# EAGLE design ADP1612_Boost_Converter (EAGLE 9.6.2)
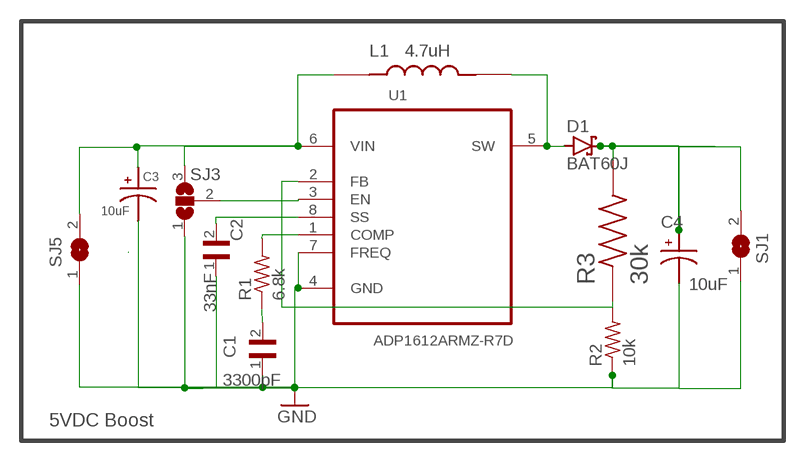
[diagram p0: schematic, sheet 1]

## Parts
C1  3300pF  GRM033R71E332KA12J  [CAPC0603X33N]
C2  33nF  GCM219R71H334KA55J  [CAPC2012X95N]
C3  10uF  EEE-1CA100SR  [CAPAE430X550N]
C4  10uF  EEE-1CA100SR  [CAPAE430X550N]
D1  BAT60J  [SOD323_ST]
L1  4.7uH  LQH43NZ4R7M03L  [IND_LQH43NZ4R7M03L]
R1  6.8k  RP73PF2A10KBTDF  [RESC2012X65N]
R2  10k  RP73PF2A10KBTDF  [RESC2012X65N]
R3  30k  352130KFT  [RESC6332X65N]
SJ1  SJW  [SJW]
SJ3  SJ2WW  [SJ_2W]
SJ5  SJW  [SJW]
U1  ADP1612ARMZ-R7D  [SOIC-08]

## Nets
5VDC: C4.1 D1.C R3.2 SJ1.2
GND: C1.1 C2.1 C3.2 C4.2 R2.1 SJ1.1 SJ3.1 SJ5.1 U1.4(GND) U1.7(FREQ)
N$1: C3.1 L1.1 SJ3.3 SJ5.2 U1.6(VIN)
N$2: C1.2 R1.1
N$3: R1.2 U1.1(COMP)
N$4: C2.2 U1.8(SS)
N$5: D1.A L1.2 U1.5(SW)
N$7: R2.2 R3.1 U1.2(FB)
N$9: SJ3.2 U1.3(EN)

## Notes on the sheet
- 5VDC Boost

## Library data of the parts
C1 = Capacitor_3300pF_smd:GRM033R71E332KA12J: CAP 0.0033UF 25VDC X7R 10% SMD 0201 PAPER TAPE Check prices <https://pricing.snapeda.com/search/part/GRM033R71E332KA12J/?ref=eda>; AVAILABILITY: Warning; DESCRIPTION: SMD Capacitor X7R(EIA) with Capacitance: 3300pF Tol. 10%. Rated Voltage: 25Vdc; MF: Murata; MP: GRM033R71E332KA12J; PACKAGE: 0603 Taiyo Yuden; PRICE: None; PURCHASE-URL: https://pricing.snapeda.com/search/part/GRM033R71E332KA12J/?ref=eda
C2 = Capacitor_0.033uF_smd:GCM219R71H334KA55J: Cap Ceramic 0.33uF 50V X7R 10% SMD 0805 125°C Paper T/R Check prices <https://pricing.snapeda.com/search/part/GCM219R71H334KA55J/?ref=eda>; AVAILABILITY: Warning; DESCRIPTION: SMD Capacitor X7R(EIA) with Capacitance: 0.33uF Tol. 10%. Rated Voltage: 50Vdc; MF: Murata; MP: GCM219R71H334KA55J; PACKAGE: 2012 Murata; PRICE: None; PURCHASE-URL: https://pricing.snapeda.com/search/part/GCM219R71H334KA55J/?ref=eda
C3 C4 = EEE-1CA100SR_10uF_SMD:EEE-1CA100SR: Capacitor Alum Elec, 10uf, 16v, 20%, Scapacitor Alum Elec, 10uf, 16v, 20%, Smd, Full Reel Check prices <https://pricing.snapeda.com/search/part/EEE-1CA100SR/?ref=eda>; AVAILABILITY: Warning; DESCRIPTION: 10µF 16V Aluminum Electrolytic Capacitors Radial, Can - SMD 2000 Hrs @ 85°C; MF: Panasonic; MP: EEE-1CA100SR; PACKAGE: RADIAL Panasonic Electronic Components; PRICE: None; PURCHASE-URL: https://pricing.snapeda.com/search/part/EEE-1CA100SR/?ref=eda
D1 = diode:BAT60J: Schottky barrier diode Source: www.st.com, BAT60J.pdf
L1 = SMD_inductor_4.7uH:LQH43NZ4R7M03L: Inductor Power Chip Unshielded Wirewound 2200uH 5% 1KHz 40Q-Factor Ferrite 0.03A 36.72Ohm DCR 1812 Automotive T/R Check prices <https://pricing.snapeda.com/search/part/LQH43NZ4R7M03L/?ref=eda>; AVAILABILITY: Warning; DESCRIPTION: Inductor with Inductance: 4.7uH Tol. +/-20%, Package: 1812 (4532); MF: Murata; MP: LQH43NZ4R7M03L; PACKAGE: NONSTANDARD; PRICE: None; PURCHASE-URL: https://pricing.snapeda.com/search/part/LQH43NZ4R7M03L/?ref=eda
R1 R2 = SMD_Res_10k:RP73PF2A10KBTDF: RES, THIN FILM, 10K, 0.1%, 0.25W, 0805 Check prices <https://pricing.snapeda.com/search/part/RP73PF2A10KBTDF/?ref=eda>; AVAILABILITY: Warning; DESCRIPTION: 10 kOhms ±0.1% 0.25W, 1/4W Chip Resistor 0805 (2012 Metric) Thin Film; MF: TE Connectivity; MP: RP73PF2A10KBTDF; PACKAGE: 0805 TE Connectivity; PRICE: None; PURCHASE-URL: https://pricing.snapeda.com/search/part/RP73PF2A10KBTDF/?ref=eda
R3 = SMD_Res_30k:352130KFT: Surface Mount Thick Film Resistor, 3520 Series, 30 kohm, 2 W, - 1%, 250 V, 2512 [6432 Metric] Check prices <https://pricing.snapeda.com/search/part/352130KFT/?ref=eda>; AVAILABILITY: Good; COMMENT: 8-2176070-4; DESCRIPTION: Surface Mount Thick Film Resistor, 3520 Series, 30 kohm, 2 W, - 1%, 250 V, 2512 [6432 Metric]; MF: TE Connectivity; MP: 352130KFT; PACKAGE: 6332 Yageo; PRICE: None; PURCHASE-URL: https://pricing.snapeda.com/search/part/352130KFT/?ref=eda
SJ1 SJ5 = jumper:SJ: SMD solder JUMPER
SJ3 = jumper:SJ2W: SMD solder JUMPER
U1 = ADP1612ARMZ-R7:ADP1612ARMZ-R7: Step-Up PWM DC-to-DC Switching Converters Check prices <https://pricing.snapeda.com/search/part/ADP1612ARMZ-R7/?ref=eda>; AVAILABILITY: Good; DESCRIPTION: Boost, SEPIC Switching Regulator IC Positive Adjustable 1.8V 1 Output 1.4A (Switch) 8-TSSOP, 8-MSOP (0.118, 3.00mm Width); MF: Analog Devices; MP: ADP1612ARMZ-R7; PACKAGE: MSOP-8 Analog Devices; PRICE: None; PURCHASE-URL: https://pricing.snapeda.com/search/part/ADP1612ARMZ-R7/?ref=eda

## Board
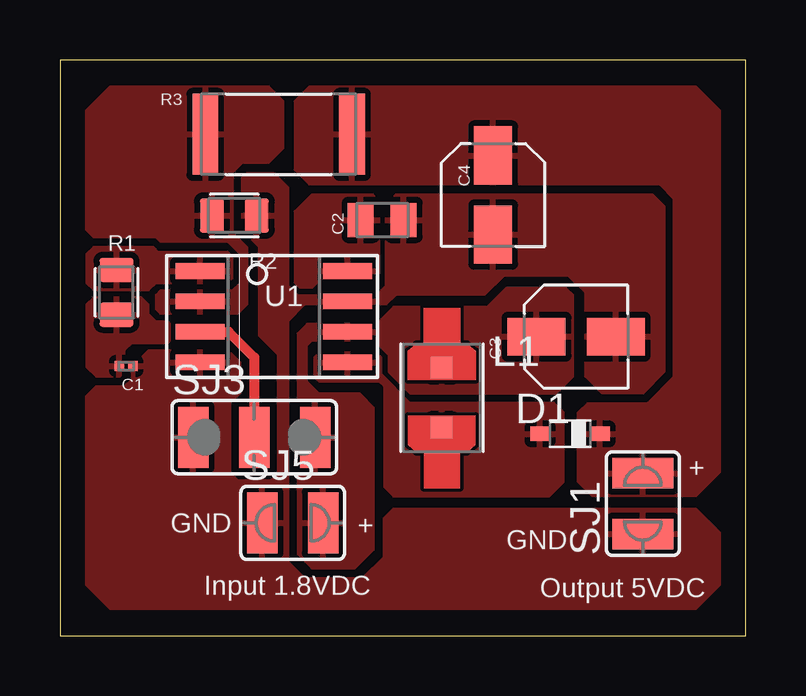
[diagram p1: board, top side]

Size 28.6 x 24 mm. Coordinates in mm from the lower left corner, seen from the top.
Outline: 0,0 28.6,0 28.6,24 0,24 0,0
Copper layers (1*16): Top 0.035mm / dielectric 1.5mm / Bottom 0.035mm
Design rules "default": minimum track width 6mil, minimum drill 0.35mm, track to track 6mil, track to pad 6mil, pad to pad 6mil, via to via 6mil, smd to smd 6mil, copper to edge 40mil, drill to drill 6mil, minimum pad ring 10mil, minimum via ring 8mil, stop-mask expansion 4mil, vias tented up to drill 0mil, thermal gap 10mil

### Footprints (pad centres in the part's own frame; a part is rotated, then mirrored left to right if it is on the bottom)
CAPC0603X33N = smd 0.38 x 0.4: 1 -0.281,0; 2 0.281,0
CAPC2012X95N = smd 1.08 x 1.42: 1 -0.895,0; 2 0.895,0
CAPAE430X550N = smd 2.42 x 1.58: 1 -1.65,0; 2 1.65,0
SOD323_ST = smd 0.8 x 0.6: A 1.25,0; C -1.25,0
IND_LQH43NZ4R7M03L = smd 0.9 x 0.9: 1 -1.25,0; 2 1.25,0
RESC2012X65N = smd 1 x 1.42: 1 -0.935,0; 2 0.935,0
RESC6332X65N = smd 1.07 x 3.37: 1 -3.055,0; 2 3.055,0
SJW = smd 1.27 x 2.54: 1 -1.27,0; 2 1.27,0
SJ_2W = smd 1.27 x 2.54: 1 -2.54,0; 2 0,0; 3 2.54,0
SOIC-08 = smd 0.66 x 2.032: 1 -1.905,-3.073; 2 -0.635,-3.073; 3 0.635,-3.073; 4 1.905,-3.073; 5 1.905,3.073; 6 0.635,3.073; 7 -0.635,3.073; 8 -1.905,3.073

### Placement (x,y rotation side)
C1  2.76,11.24 180 top
C2  13.43,17.33 180 top
C3  21.52,12.46 0 top
C4  18.06,18.37 270 top
D1  21.27,8.41 180 top
L1  15.92,9.91 270 top
R1  2.36,14.31 90 top
R2  7.27,17.51 180 top
R3  9.12,20.9 0 top
SJ1  24.3,5.5 90 top
SJ3  8.1,8.27 0 top
SJ5  9.7,4.7 0 top
U1  8.92,13.3 270 top

### Tracks (layer width: path | path; a pad name or v marks a point on that pad's centre or on a via)
5VDC
  pour Top: 22.2,5.8 21.6,6.4 21.6,9.3 22,9.7 24.5,9.7 25.6,10.8 25.6,18.2 25,18.8 10.4,18.8 9.8,19.4 9.8,22.3 10.4,22.9 26.5,22.9 27.5,21.9 27.5,6.8 26.5,5.8
GND
  pour Top: 3,10.7 3,11.2 3.7,11.9 7,11.9 7.5,11.4 7.5,10.1 7.1,9.7 7.1,6.8 7.4,6.5 8.8,6.5 9.1,6.8 9.1,11.7 8.3,12.5 8.3,16.2 7.6,16.9 7.6,19.1 7.8,19.3 8.9,19.3 9.5,18.7 9.5,14.6 9.9,14.2 13.2,14.2 13.6,14.6 13.6,18 14,18.4 24.7,18.4 25.2,17.9 25.2,11 24.32,10.1 22.6,10.1 21.9,10.8 21.9,14.3 21.2,15 18.5,15 17.7,14.2 14,14.2 13.6,13.8 10.2,13.8 9.5,13.1 9.5,3.1 10.2,2.4 12.61,2.4 13.5,3.29 13.5,4.9 13.9,5.3 26.5,5.3 27.5,4.3 27.5,2.1 26.5,1.1 2.1,1.1 1.1,2.1 1.1,10 1.5,10.4 2.7,10.4
N$1
  pour Top: 9.9,12.6 9.9,3.4 10.5,2.8 12.3,2.8 13.1,3.6 13.1,9.5 12.5,10.1 10.8,10.1 10.3,10.6 10.3,12.1 10.5,12.3 13.1,12.3 13.7,11.7 13.7,11 14.6,10.1 20.7,10.1 21.4,10.8 21.4,14.2 21.1,14.5 18.6,14.5 17.8,13.7 13.9,13.7 13.2,13 10.3,13
N$2
  Top 0.406: 2.48,13.26 R1.1
  pour Top: 2.5,10.8 2.7,11 2.7,11.9 3,12.2 4.5,12.2 4.6,12.3 4.6,13 4.5,13.1 4,13.1 3.7,13.4 3.7,13.8 3.4,14.1 1.4,14.1 1.1,13.8 1.1,11.2 1.5,10.8
N$3
  pour Top: 1.1,14.7 1.4,14.4 3.7,14.4 4,14.7 7,14.7 7.2,14.9 7.2,15.8 7,16 4.1,16 3.9,16.2 1.4,16.2 1.1,15.9
N$4
  pour Top: 9.8,14.7 9.8,17.7 10.5,18.4 13.03,18.4 13.3,18.13 13.3,15.1 13.1,14.9 10.9,14.9 10.5,14.5 10,14.5
N$5
  pour Top: 10.6,10.8 10.8,10.6 13.3,10.6 13.5,10.4 13.5,6.2 13.9,5.8 20.4,5.8 21,6.4 21,9.3 20.6,9.7 14.6,9.7 13.4,10.9 13.4,11.6 13.2,11.8 10.8,11.8 10.6,11.6
N$7
  pour Top: 7.5,15.9 7,16.4 4.2,16.4 4,16.6 1.4,16.6 1.1,16.9 1.1,21.9 2.1,22.9 8.7,22.9 9.3,22.3 9.3,20.3 8.7,19.7 7.6,19.7 7.2,19.3 7.2,16.8 7.8,16.2 7.8,13.8 7.4,13.4 4.2,13.4 4,13.6 4,14.2 4.2,14.4 7.2,14.4 7.5,14.7
N$9
  Top 0.406: U1.3 7.04,12.66 8.1,11.6 SJ3.2

### Text on the board
tNames: + | GND | + | GND | Input 1.8VDC | Output 5VDC